# EAGLE schematic Led_Driver_27V (EAGLE 6.5.0)
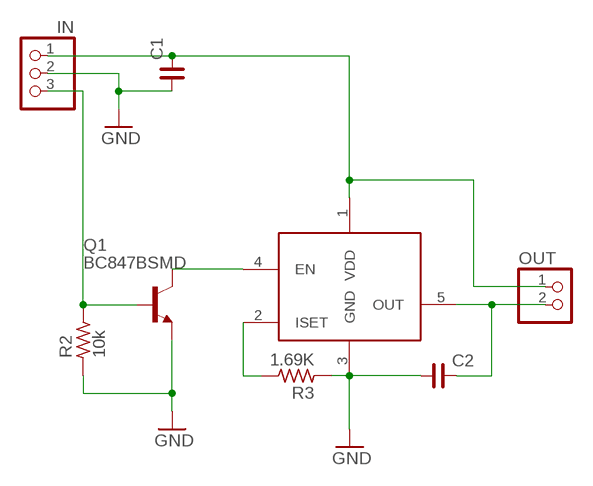
[diagram p0: schematic, sheet 1]

## Parts
C1  C_0603  [C0603]
C2  C_0603  [C0603]
IN  PINHD-1X03_2.54-S  [1X03-S]
OUT  PINHD-1X02_2.54-S  [1X02-S]
Q1  BC847BSMD  [SOT23]
R2  10k  R_1206  [R1206]
R3  1.69K  R_1206  [R1206]
U$1  AMC7140  [TO252-5L]

## Nets
GND: C1.1 C2.1 IN.2 Q1.2(E) R2.1 R3.1 U$1.3(GND)
N$1: C2.2 OUT.2 U$1.5(OUT)
N$3: Q1.3(C) U$1.4(EN)
N$4: R3.2 U$1.2(ISET)
N$5: IN.3 Q1.1(B) R2.2
VDD: C1.2 IN.1 OUT.1 U$1.1(VDD)

## Library data of the parts
C1 C2 = rc-master-smd:C_: NON-POLARIZED CAP
IN = pinhead-2:PINHD-1X03: PIN HEADER
OUT = pinhead-2:PINHD-1X02: PIN HEADER
Q1 = transistor-npn:BC847*: NPN Transistor
R2 R3 = rc-master-smd:R_: RESISTOR
U$1 = my-library:AMC7140